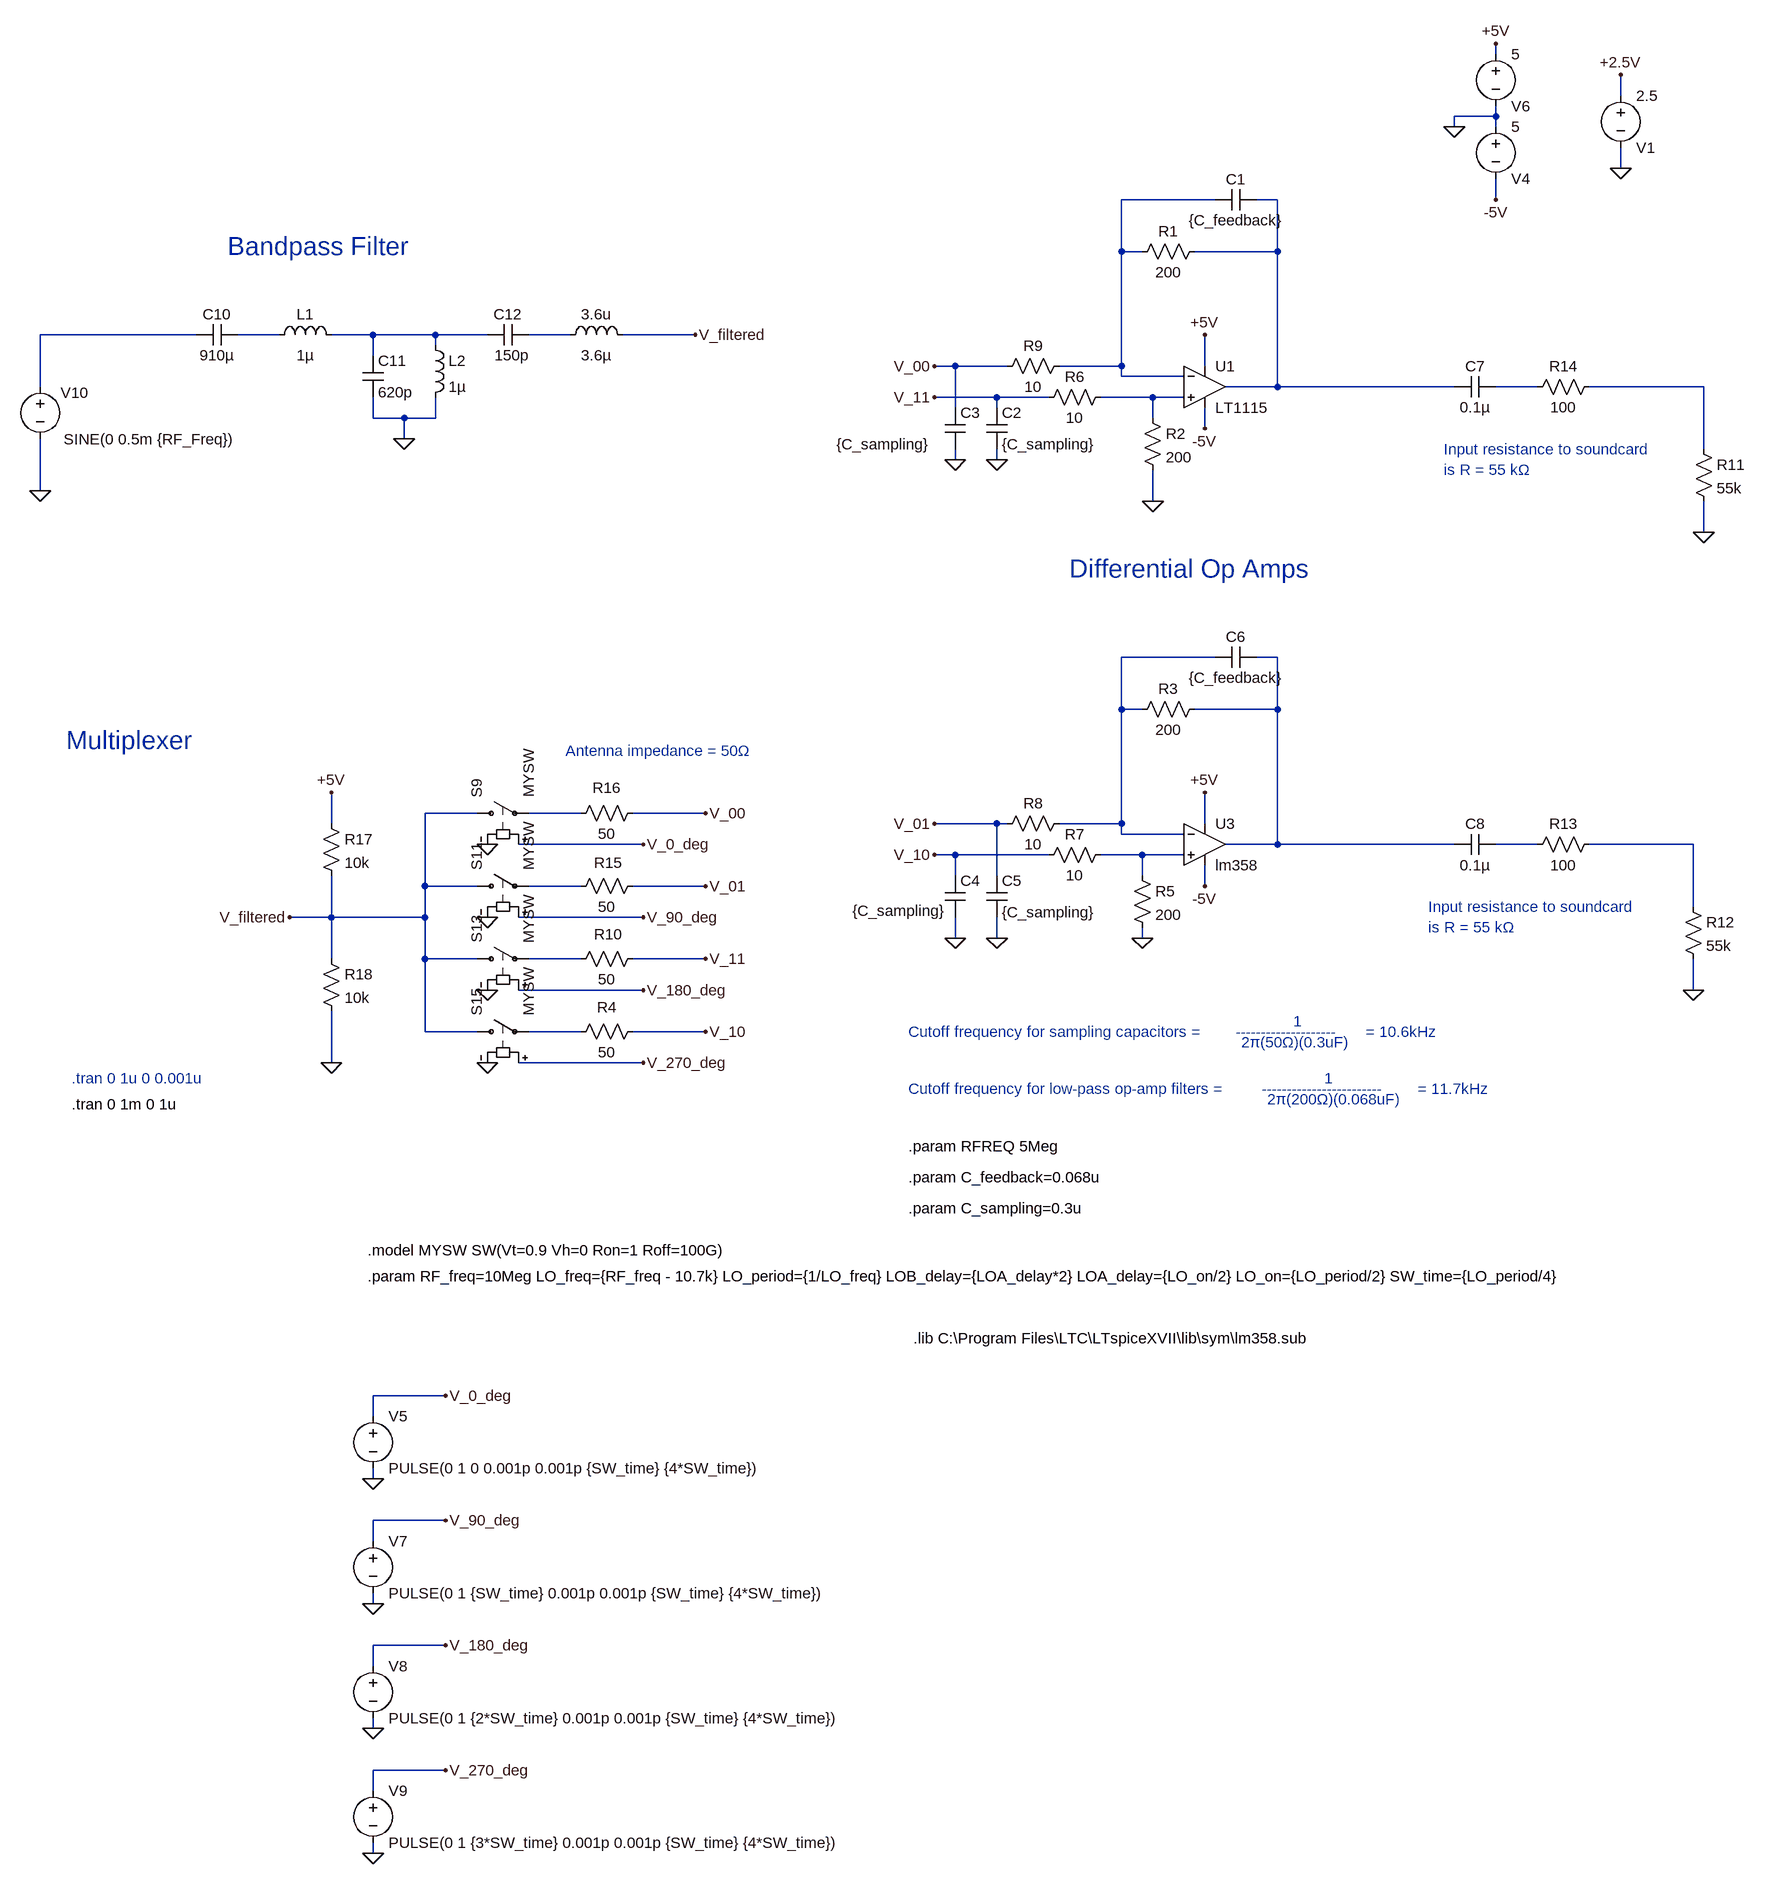
[diagram p0: schematic RecieverSimulation_1b.asc]
RecieverSimulation_1b.asc, the LTspice schematic file:
Version 4
SHEET 1 2332 3096
WIRE 1632 -1280 1632 -1296
WIRE 1824 -1216 1824 -1248
WIRE 1632 -1184 1632 -1200
WIRE 1632 -1184 1568 -1184
WIRE 1568 -1168 1568 -1184
WIRE 1632 -1168 1632 -1184
WIRE 1824 -1104 1824 -1136
WIRE 1200 -1056 1056 -1056
WIRE 1296 -1056 1264 -1056
WIRE 1632 -1056 1632 -1088
WIRE 1056 -976 1056 -1056
WIRE 1088 -976 1056 -976
WIRE 1296 -976 1296 -1056
WIRE 1296 -976 1168 -976
WIRE -368 -848 -608 -848
WIRE -240 -848 -304 -848
WIRE -96 -848 -160 -848
WIRE 0 -848 -96 -848
WIRE 80 -848 0 -848
WIRE 208 -848 144 -848
WIRE 400 -848 288 -848
WIRE 0 -832 0 -848
WIRE -96 -816 -96 -848
WIRE 800 -800 768 -800
WIRE 880 -800 800 -800
WIRE 1056 -800 1056 -976
WIRE 1056 -800 960 -800
WIRE 1184 -800 1184 -848
WIRE 1056 -784 1056 -800
WIRE 1152 -784 1056 -784
WIRE -608 -768 -608 -848
WIRE 1296 -768 1296 -976
WIRE 1296 -768 1216 -768
WIRE 1568 -768 1296 -768
WIRE 1696 -768 1632 -768
WIRE 1952 -768 1776 -768
WIRE 864 -752 768 -752
WIRE 944 -752 864 -752
WIRE 1104 -752 1024 -752
WIRE 1152 -752 1104 -752
WIRE 800 -736 800 -800
WIRE 864 -736 864 -752
WIRE -96 -720 -96 -752
WIRE -48 -720 -96 -720
WIRE 0 -720 0 -752
WIRE 0 -720 -48 -720
WIRE 1104 -720 1104 -752
WIRE 1184 -704 1184 -736
WIRE -48 -688 -48 -720
WIRE 1952 -672 1952 -768
WIRE 800 -656 800 -672
WIRE 864 -656 864 -672
WIRE -608 -608 -608 -688
WIRE 1104 -592 1104 -640
WIRE 1952 -544 1952 -592
WIRE 1200 -352 1056 -352
WIRE 1296 -352 1264 -352
WIRE 1056 -272 1056 -352
WIRE 1088 -272 1056 -272
WIRE 1296 -272 1296 -352
WIRE 1296 -272 1168 -272
WIRE 64 -112 -16 -112
WIRE 224 -112 144 -112
WIRE 416 -112 304 -112
WIRE -160 -96 -160 -144
WIRE 864 -96 768 -96
WIRE 880 -96 864 -96
WIRE 1056 -96 1056 -272
WIRE 1056 -96 960 -96
WIRE 1184 -96 1184 -144
WIRE 1056 -80 1056 -96
WIRE 1152 -80 1056 -80
WIRE 320 -64 128 -64
WIRE 1296 -64 1296 -272
WIRE 1296 -64 1216 -64
WIRE 1568 -64 1296 -64
WIRE 1696 -64 1632 -64
WIRE 1936 -64 1776 -64
WIRE 800 -48 768 -48
WIRE 944 -48 800 -48
WIRE 1088 -48 1024 -48
WIRE 1152 -48 1088 -48
WIRE 800 -16 800 -48
WIRE 864 -16 864 -96
WIRE 1088 -16 1088 -48
WIRE -16 0 -16 -112
WIRE 64 0 -16 0
WIRE 224 0 144 0
WIRE 416 0 304 0
WIRE 1184 0 1184 -32
WIRE 1936 32 1936 -64
WIRE -160 48 -160 -16
WIRE -160 48 -224 48
WIRE -16 48 -16 0
WIRE -16 48 -160 48
WIRE 320 48 128 48
WIRE 800 80 800 48
WIRE 864 80 864 48
WIRE 1088 80 1088 64
WIRE -160 112 -160 48
WIRE -16 112 -16 48
WIRE 64 112 -16 112
WIRE 224 112 144 112
WIRE 416 112 304 112
WIRE 320 160 128 160
WIRE 1936 160 1936 112
WIRE -16 224 -16 112
WIRE 64 224 -16 224
WIRE 224 224 144 224
WIRE 416 224 304 224
WIRE -160 272 -160 192
WIRE 320 272 128 272
WIRE 16 784 -96 784
WIRE -96 816 -96 784
WIRE -96 912 -96 896
WIRE 16 976 -96 976
WIRE -96 1008 -96 976
WIRE -96 1104 -96 1088
WIRE 16 1168 -96 1168
WIRE -96 1200 -96 1168
WIRE -96 1296 -96 1280
WIRE 16 1360 -96 1360
WIRE -96 1392 -96 1360
WIRE -96 1488 -96 1472
FLAG 416 -112 V_00
FLAG 416 0 V_01
FLAG 416 112 V_11
FLAG 416 224 V_10
FLAG 864 -656 0
FLAG 800 -656 0
FLAG 1936 160 0
FLAG 1952 -544 0
FLAG 1568 -1168 0
FLAG 1632 -1056 -5V
FLAG 1632 -1296 +5V
FLAG 768 -752 V_11
FLAG 768 -800 V_00
FLAG 768 -48 V_10
FLAG 768 -96 V_01
FLAG 1184 -704 -5V
FLAG 1184 -848 +5V
FLAG -96 912 0
FLAG 16 784 V_0_deg
FLAG -96 1104 0
FLAG 16 976 V_90_deg
FLAG -96 1296 0
FLAG 16 1168 V_180_deg
FLAG -96 1488 0
FLAG 16 1360 V_270_deg
FLAG 80 -64 0
FLAG 80 48 0
FLAG 80 160 0
FLAG 80 272 0
FLAG -608 -608 0
FLAG 320 -64 V_0_deg
FLAG 320 48 V_90_deg
FLAG 320 160 V_180_deg
FLAG 320 272 V_270_deg
FLAG 1824 -1104 0
FLAG 1824 -1248 +2.5V
FLAG 800 80 0
FLAG 864 80 0
FLAG 1104 -592 0
FLAG 1184 -144 +5V
FLAG 1088 80 0
FLAG 1184 0 -5V
FLAG -160 272 0
FLAG -160 -144 +5V
FLAG -48 -688 0
FLAG 400 -848 V_filtered
FLAG -224 48 V_filtered
SYMBOL Opamps\\LT1115 1184 -832 R0
SYMATTR InstName U1
SYMBOL voltage 1632 -1184 R0
WINDOW 0 24 96 Left 2
WINDOW 3 24 16 Left 2
WINDOW 123 0 0 Left 0
WINDOW 39 0 0 Left 0
SYMATTR InstName V4
SYMATTR Value 5
SYMBOL res 1040 -768 R90
WINDOW 0 0 56 VBottom 2
WINDOW 3 32 56 VTop 2
SYMATTR InstName R6
SYMATTR Value 10
SYMBOL res 1040 -64 R90
WINDOW 0 0 56 VBottom 2
WINDOW 3 32 56 VTop 2
SYMATTR InstName R7
SYMATTR Value 10
SYMBOL cap 848 -736 R0
SYMATTR InstName C2
SYMATTR Value {C_sampling}
SYMBOL cap 784 -736 R0
WINDOW 3 -167 56 Left 2
SYMATTR Value {C_sampling}
SYMATTR InstName C3
SYMBOL res 976 -112 R90
WINDOW 0 0 56 VBottom 2
WINDOW 3 32 56 VTop 2
SYMATTR InstName R8
SYMATTR Value 10
SYMBOL res 976 -816 R90
WINDOW 0 0 56 VBottom 2
WINDOW 3 32 56 VTop 2
SYMATTR InstName R9
SYMATTR Value 10
SYMBOL res 1936 -688 R0
SYMATTR InstName R11
SYMATTR Value 55k
SYMBOL res 1920 16 R0
SYMATTR InstName R12
SYMATTR Value 55k
SYMBOL cap 1632 -784 R90
WINDOW 0 0 32 VBottom 2
WINDOW 3 32 32 VTop 2
SYMATTR InstName C7
SYMATTR Value 0.1µ
SYMBOL cap 1632 -80 R90
WINDOW 0 0 32 VBottom 2
WINDOW 3 32 32 VTop 2
SYMATTR InstName C8
SYMATTR Value 0.1µ
SYMBOL res 1792 -80 R90
WINDOW 0 0 56 VBottom 2
WINDOW 3 32 56 VTop 2
SYMATTR InstName R13
SYMATTR Value 100
SYMBOL res 1792 -784 R90
WINDOW 0 0 56 VBottom 2
WINDOW 3 32 56 VTop 2
SYMATTR InstName R14
SYMATTR Value 100
SYMBOL voltage 1632 -1296 R0
WINDOW 0 24 96 Left 2
WINDOW 3 24 16 Left 2
WINDOW 123 0 0 Left 0
WINDOW 39 0 0 Left 0
SYMATTR InstName V6
SYMATTR Value 5
SYMBOL res 1184 -992 R90
WINDOW 0 0 56 VBottom 2
WINDOW 3 32 56 VTop 2
SYMATTR InstName R1
SYMATTR Value 200
SYMBOL voltage -96 800 R0
WINDOW 123 0 0 Left 0
WINDOW 39 0 0 Left 0
SYMATTR InstName V5
SYMATTR Value PULSE(0 1 0 0.001p 0.001p {SW_time} {4*SW_time})
SYMBOL voltage -96 992 R0
WINDOW 123 0 0 Left 0
WINDOW 39 0 0 Left 0
SYMATTR InstName V7
SYMATTR Value PULSE(0 1 {SW_time} 0.001p 0.001p {SW_time} {4*SW_time})
SYMBOL voltage -96 1184 R0
WINDOW 123 0 0 Left 0
WINDOW 39 0 0 Left 0
SYMATTR InstName V8
SYMATTR Value PULSE(0 1 {2*SW_time} 0.001p 0.001p {SW_time} {4*SW_time})
SYMBOL voltage -96 1376 R0
WINDOW 123 0 0 Left 0
WINDOW 39 0 0 Left 0
SYMATTR InstName V9
SYMATTR Value PULSE(0 1 {3*SW_time} 0.001p 0.001p {SW_time} {4*SW_time})
SYMBOL sw 48 -112 R270
SYMATTR InstName S9
SYMATTR Value MYSW
SYMBOL sw 48 0 R270
SYMATTR InstName S11
SYMATTR Value MYSW
SYMBOL sw 48 112 R270
SYMATTR InstName S13
SYMATTR Value MYSW
SYMBOL sw 48 224 R270
SYMATTR InstName S15
SYMATTR Value MYSW
SYMBOL voltage -608 -784 R0
WINDOW 0 53 41 Bottom 2
WINDOW 3 169 81 Top 2
WINDOW 123 0 0 Left 0
WINDOW 39 60 56 VTop 2
SYMATTR InstName V10
SYMATTR Value SINE(0 0.5m {RF_Freq})
SYMBOL voltage 1824 -1232 R0
WINDOW 0 24 96 Left 2
WINDOW 3 24 16 Left 2
WINDOW 123 0 0 Left 0
WINDOW 39 0 0 Left 0
SYMATTR InstName V1
SYMATTR Value 2.5
SYMBOL cap 784 -16 R0
WINDOW 3 -142 54 Left 2
SYMATTR Value {C_sampling}
SYMATTR InstName C4
SYMBOL cap 848 -16 R0
SYMATTR InstName C5
SYMATTR Value {C_sampling}
SYMBOL res 1088 -736 R0
SYMATTR InstName R2
SYMATTR Value 200
SYMBOL cap 1264 -1072 R90
WINDOW 0 0 32 VBottom 2
WINDOW 3 32 32 VTop 2
SYMATTR InstName C1
SYMATTR Value {C_feedback}
SYMBOL res 1184 -288 R90
WINDOW 0 0 56 VBottom 2
WINDOW 3 32 56 VTop 2
SYMATTR InstName R3
SYMATTR Value 200
SYMBOL cap 1264 -368 R90
WINDOW 0 0 32 VBottom 2
WINDOW 3 32 32 VTop 2
SYMATTR InstName C6
SYMATTR Value {C_feedback}
SYMBOL res 1072 -32 R0
SYMATTR InstName R5
SYMATTR Value 200
SYMBOL res 320 208 R90
WINDOW 0 -6 56 VBottom 2
WINDOW 3 32 56 VTop 2
SYMATTR InstName R4
SYMATTR Value 50
SYMBOL res 320 96 R90
WINDOW 0 -6 54 VBottom 2
WINDOW 3 32 56 VTop 2
SYMATTR InstName R10
SYMATTR Value 50
SYMBOL res 320 -16 R90
WINDOW 0 -4 54 VBottom 2
WINDOW 3 32 56 VTop 2
SYMATTR InstName R15
SYMATTR Value 50
SYMBOL res 320 -128 R90
WINDOW 0 -8 56 VBottom 2
WINDOW 3 32 56 VTop 2
SYMATTR InstName R16
SYMATTR Value 50
SYMBOL res -176 -112 R0
SYMATTR InstName R17
SYMATTR Value 10k
SYMBOL res -176 96 R0
SYMATTR InstName R18
SYMATTR Value 10k
SYMBOL Opamps\\opamp2 1184 -128 R0
SYMATTR InstName U3
SYMATTR Value lm358
SYMBOL cap -304 -864 R90
WINDOW 0 0 32 VBottom 2
WINDOW 3 32 32 VTop 2
SYMATTR InstName C10
SYMATTR Value 910µ
SYMBOL ind -256 -832 R270
WINDOW 0 32 56 VTop 2
WINDOW 3 0 56 VBottom 2
SYMATTR InstName L1
SYMATTR Value 1µ
SYMBOL cap -112 -816 R0
SYMATTR InstName C11
SYMATTR Value 620p
SYMBOL ind -16 -848 R0
SYMATTR InstName L2
SYMATTR Value 1µ
SYMBOL cap 144 -864 R90
WINDOW 0 0 32 VBottom 2
WINDOW 3 32 26 VTop 2
SYMATTR InstName C12
SYMATTR Value 150p
SYMBOL ind 192 -832 R270
WINDOW 0 32 56 VTop 2
WINDOW 3 0 56 VBottom 2
SYMATTR InstName 3.6u
SYMATTR Value 3.6µ
TEXT -104 560 Left 2 !.model MYSW SW(Vt=0.9 Vh=0 Ron=1 Roff=100G)
TEXT -560 336 Left 2 !.tran 0 1m 0 1u
TEXT 728 400 Left 2 !.param RFREQ 5Meg
TEXT -104 600 Left 2 !.param RF_freq=10Meg LO_freq={RF_freq - 10.7k} LO_period={1/LO_freq} LOB_delay={LOA_delay*2} LOA_delay={LO_on/2} LO_on={LO_period/2} SW_time={LO_period/4}
TEXT -568 -224 Left 4 ;Multiplexer
TEXT 728 448 Left 2 !.param C_feedback=0.068u
TEXT 728 496 Left 2 !.param C_sampling=0.3u
TEXT 728 224 Left 2 ;Cutoff frequency for sampling capacitors =
TEXT 1240 240 Left 2 ;2π(50Ω)(0.3uF)
TEXT 1232 224 Left 2 ;--------------------
TEXT 1320 208 Left 2 ;1
TEXT 1432 224 Left 2 ;= 10.6kHz
TEXT 728 312 Left 2 ;Cutoff frequency for low-pass op-amp filters =
TEXT 1280 328 Left 2 ;2π(200Ω)(0.068uF)
TEXT 1272 312 Left 2 ;------------------------
TEXT 1368 296 Left 2 ;1
TEXT 1512 312 Left 2 ;= 11.7kHz
TEXT 200 -208 Left 2 ;Antenna impedance = 50Ω
TEXT 976 -488 Left 4 ;Differential Op Amps
TEXT 1552 -672 Left 2 ;Input resistance to soundcard\nis R = 55 kΩ
TEXT 1528 32 Left 2 ;Input resistance to soundcard\nis R = 55 kΩ
TEXT -560 296 Left 2 ;.tran 0 1u 0 0.001u
TEXT 736 696 Left 2 !.lib C:\\Program Files\\LTC\\LTspiceXVII\\lib\\sym\\lm358.sub
TEXT -320 -984 Left 4 ;Bandpass Filter

The netlist it stands for:
* RecieverSimulation_1b.asc
XU1 N009 N001 +5V -5V N002 LT1028  ; LT1115, pins In+ In- V+ V- OUT
V4 0 -5V 5
R6 N009 V_11 10
R7 N015 V_10 10
C2 V_11 0 {C_sampling}
C3 V_00 0 {C_sampling}
R8 N010 V_01 10
R9 N001 V_00 10
R11 N008 0 55k
R12 N014 0 55k
C7 N007 N002 0.1µ
C8 N013 N011 0.1µ
R13 N014 N013 100
R14 N008 N007 100
V6 +5V 0 5
R1 N002 N001 200
V5 V_0_deg 0 PULSE(0 1 0 0.001p 0.001p {SW_time} {4*SW_time})
V7 V_90_deg 0 PULSE(0 1 {SW_time} 0.001p 0.001p {SW_time} {4*SW_time})
V8 V_180_deg 0 PULSE(0 1 {2*SW_time} 0.001p 0.001p {SW_time} {4*SW_time})
V9 V_270_deg 0 PULSE(0 1 {3*SW_time} 0.001p 0.001p {SW_time} {4*SW_time})
S9 V_filtered N012 V_0_deg 0 MYSW
S11 V_filtered N016 V_90_deg 0 MYSW
S13 V_filtered N017 V_180_deg 0 MYSW
S15 V_filtered N018 V_270_deg 0 MYSW
V10 N003 0 SINE(0 0.5m {RF_Freq})
V1 +2.5V 0 2.5
C4 V_10 0 {C_sampling}
C5 V_01 0 {C_sampling}
R2 N009 0 200
C1 N002 N001 {C_feedback}
R3 N011 N010 200
C6 N011 N010 {C_feedback}
R5 N015 0 200
R4 V_10 N018 50
R10 V_11 N017 50
R15 V_01 N016 50
R16 V_00 N012 50
R17 +5V V_filtered 10k
R18 V_filtered 0 10k
XU3 N015 N010 +5V -5V N011 lm358  ; pins In+ In- V+ V- OUT
C10 N004 N003 910µ
L1 N004 N005 1µ
C11 N005 0 620p
L2 N005 0 1µ
C12 N006 N005 150p
L§3.6u N006 V_filtered 3.6µ
.model MYSW SW(Vt=0.9 Vh=0 Ron=1 Roff=100G)
.tran 0 1m 0 1u
.param RFREQ 5Meg
.param RF_freq=10Meg LO_freq={RF_freq - 10.7k} LO_period={1/LO_freq} LOB_delay={LOA_delay*2} LOA_delay={LO_on/2} LO_on={LO_period/2} SW_time={LO_period/4}
* Multiplexer
.param C_feedback=0.068u
.param C_sampling=0.3u
* Cutoff frequency for sampling capacitors =
* 2π(50Ω)(0.3uF)
* --------------------
* 1
* = 10.6kHz
* Cutoff frequency for low-pass op-amp filters =
* 2π(200Ω)(0.068uF)
* ------------------------
* 1
* = 11.7kHz
* Antenna impedance = 50Ω
* Differential Op Amps
* Input resistance to soundcard
* is R = 55 kΩ
* Input resistance to soundcard
* is R = 55 kΩ
* .tran 0 1u 0 0.001u
.lib C:\Program Files\LTC\LTspiceXVII\lib\sym\lm358.sub
* Bandpass Filter
.lib LTC.lib
.backanno
.end